# Altium schematic sheet PROC054D_AWR_2_AWR_3_LC_Filtering.SchDoc: AWR_2_AWR_3_LC_Filtering
size 558 x 431 mm; Date: Not shown in title block; ApprovedBy: Not shown in title block; CheckedBy: Not shown in title block; Author: Not shown in title block; CompanyName: Not shown in title block; DrawnBy: a0271760; Engineer: Not shown in title block; Organization: Not shown in title block; Address1: Not shown in title block; Address2: Not shown in title block; Address3: Not shown in title block; Address4: Not shown in title block; DocumentNumber: 7; Revision: Use project pAWRameter SCH_Rev; SheetNumber: 7; SheetTotal: 19; PageSetup: Record=PageOptions|CenterHorizontal=True|CenterVertical=True|PrintScale=1.00|XCorrection=1.00|YCorrection=1.00|PrintKind=0|BorderSize=5000000|LeftOffset=0|BottomOffset=0|Orientation=2|PaperLength=1000|PaperWidth=1000|Scale=100|PaperSource=15|PrintQuality=600|MediaType=1|DitherType=10|PaperKind=Letter|PrintScaleMode=1; CurrentTime: Not shown in title block; CurrentDate: Not shown in title block; Time: Not shown in title block; DocumentFullPathAndName: Not shown in title block; DocumentName: Not shown in title block; ModifiedDate: Not shown in title block; ImagePath: Not shown in title block
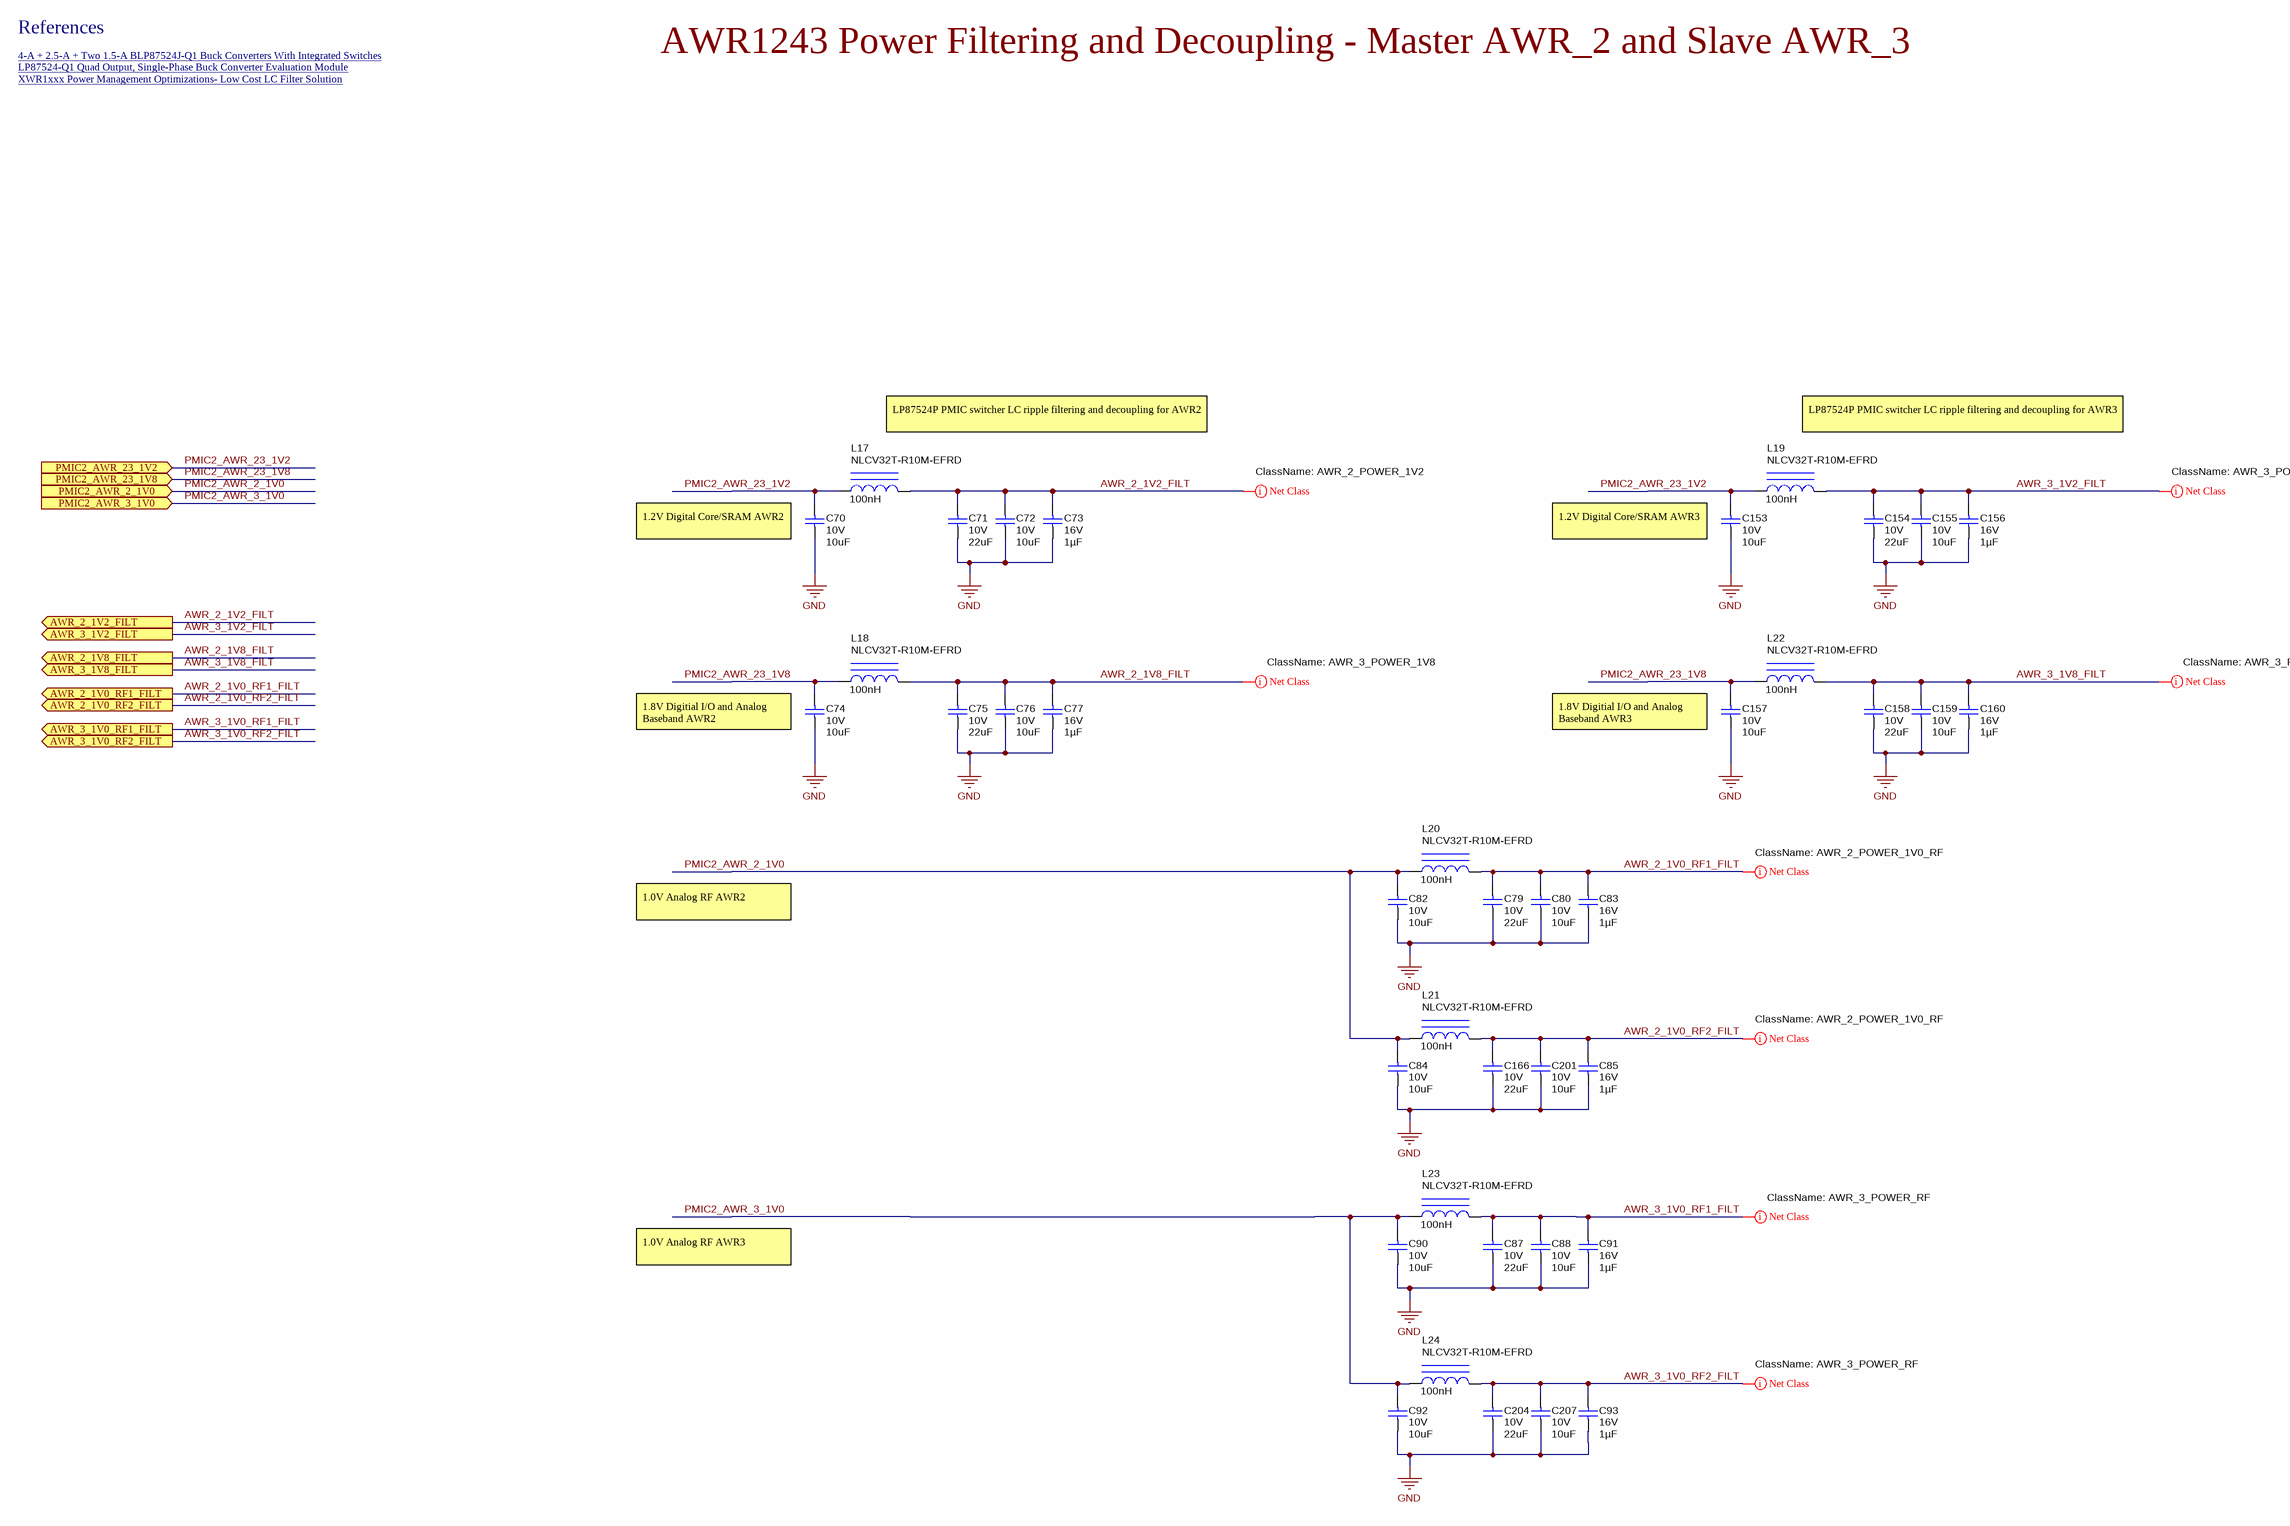
[diagram p0: PROC054D_AWR_2_AWR_3_LC_Filtering.SchDoc]

## Parts
C70  VDC_V: 10V  ValueDisplayed: 10uF  [0805L]  (hidden comment: GCM21BR71A106KE22L)
C71  VDC_V: 10V  ValueDisplayed: 22uF  [1206_180L]  (hidden comment: GCM31CR71A226KE02)
C72  VDC_V: 10V  ValueDisplayed: 10uF  [0805L]  (hidden comment: GCM21BR71A106KE22L)
C73  VDC_V: 16V  ValueDisplayed: 1µF  [0603S]  (hidden comment: GCM188R71C105KA64J)
C74  VDC_V: 10V  ValueDisplayed: 10uF  [0805L]  (hidden comment: GCM21BR71A106KE22L)
C75  VDC_V: 10V  ValueDisplayed: 22uF  [1206_180L]  (hidden comment: GCM31CR71A226KE02)
C76  VDC_V: 10V  ValueDisplayed: 10uF  [0805L]  (hidden comment: GCM21BR71A106KE22L)
C77  VDC_V: 16V  ValueDisplayed: 1µF  [0603S]  (hidden comment: GCM188R71C105KA64J)
C79  VDC_V: 10V  ValueDisplayed: 22uF  [1206_180L]  (hidden comment: GCM31CR71A226KE02)
C80  VDC_V: 10V  ValueDisplayed: 10uF  [0805L]  (hidden comment: GCM21BR71A106KE22L)
C82  VDC_V: 10V  ValueDisplayed: 10uF  [0805L]  (hidden comment: GCM21BR71A106KE22L)
C83  VDC_V: 16V  ValueDisplayed: 1µF  [0603S]  (hidden comment: GCM188R71C105KA64J)
C84  VDC_V: 10V  ValueDisplayed: 10uF  [0805L]  (hidden comment: GCM21BR71A106KE22L)
C85  VDC_V: 16V  ValueDisplayed: 1µF  [0603S]  (hidden comment: GCM188R71C105KA64J)
C87  VDC_V: 10V  ValueDisplayed: 22uF  [1206_180L]  (hidden comment: GCM31CR71A226KE02)
C88  VDC_V: 10V  ValueDisplayed: 10uF  [0805L]  (hidden comment: GCM21BR71A106KE22L)
C90  VDC_V: 10V  ValueDisplayed: 10uF  [0805L]  (hidden comment: GCM21BR71A106KE22L)
C91  VDC_V: 16V  ValueDisplayed: 1µF  [0603S]  (hidden comment: GCM188R71C105KA64J)
C92  VDC_V: 10V  ValueDisplayed: 10uF  [0805L]  (hidden comment: GCM21BR71A106KE22L)
C93  VDC_V: 16V  ValueDisplayed: 1µF  [0603S]  (hidden comment: GCM188R71C105KA64J)
C153  VDC_V: 10V  ValueDisplayed: 10uF  [0805L]  (hidden comment: GCM21BR71A106KE22L)
C154  VDC_V: 10V  ValueDisplayed: 22uF  [1206_180L]  (hidden comment: GCM31CR71A226KE02)
C155  VDC_V: 10V  ValueDisplayed: 10uF  [0805L]  (hidden comment: GCM21BR71A106KE22L)
C156  VDC_V: 16V  ValueDisplayed: 1µF  [0603S]  (hidden comment: GCM188R71C105KA64J)
C157  VDC_V: 10V  ValueDisplayed: 10uF  [0805L]  (hidden comment: GCM21BR71A106KE22L)
C158  VDC_V: 10V  ValueDisplayed: 22uF  [1206_180L]  (hidden comment: GCM31CR71A226KE02)
C159  VDC_V: 10V  ValueDisplayed: 10uF  [0805L]  (hidden comment: GCM21BR71A106KE22L)
C160  VDC_V: 16V  ValueDisplayed: 1µF  [0603S]  (hidden comment: GCM188R71C105KA64J)
C166  VDC_V: 10V  ValueDisplayed: 22uF  [1206_180L]  (hidden comment: GCM31CR71A226KE02)
C201  VDC_V: 10V  ValueDisplayed: 10uF  [0805L]  (hidden comment: GCM21BR71A106KE22L)
C204  VDC_V: 10V  ValueDisplayed: 22uF  [1206_180L]  (hidden comment: GCM31CR71A226KE02)
C207  VDC_V: 10V  ValueDisplayed: 10uF  [0805L]  (hidden comment: GCM21BR71A106KE22L)
L17  ValueDisplayed: 100nH  [NLCV32]  (hidden comment: NLCV32T-R10M-EFRD)
L18  ValueDisplayed: 100nH  [NLCV32]  (hidden comment: NLCV32T-R10M-EFRD)
L19  ValueDisplayed: 100nH  [NLCV32]  (hidden comment: NLCV32T-R10M-EFRD)
L20  ValueDisplayed: 100nH  [NLCV32]  (hidden comment: NLCV32T-R10M-EFRD)
L21  ValueDisplayed: 100nH  [NLCV32]  (hidden comment: NLCV32T-R10M-EFRD)
L22  ValueDisplayed: 100nH  [NLCV32]  (hidden comment: NLCV32T-R10M-EFRD)
L23  ValueDisplayed: 100nH  [NLCV32]  (hidden comment: NLCV32T-R10M-EFRD)
L24  ValueDisplayed: 100nH  [NLCV32]  (hidden comment: NLCV32T-R10M-EFRD)

## Ports
AWR_2_1V0_RF1_FILT (out), AWR_2_1V0_RF2_FILT (out), AWR_2_1V2_FILT (out), AWR_2_1V8_FILT (out), AWR_3_1V0_RF1_FILT (out), AWR_3_1V0_RF2_FILT (out), AWR_3_1V2_FILT (out), AWR_3_1V8_FILT (out), PMIC2_AWR_2_1V0 (in), PMIC2_AWR_3_1V0 (in), PMIC2_AWR_23_1V2 (in), PMIC2_AWR_23_1V8 (in)

## Nets
GND: C70.2 C71.2 C72.2 C73.2 C74.2 C75.2 C76.2 C77.2 C79.2 C80.2 C82.2 C83.2 C84.2 C85.2 C87.2 C88.2 C90.2 C91.2 C92.2 C93.2 C153.2 C154.2 C155.2 C156.2 C157.2 C158.2 C159.2 C160.2 C166.2 C201.2 C204.2 C207.2
AWR_2_1V0_RF1_FILT: C79.1 C80.1 C83.1 L20.2 ; port AWR_2_1V0_RF1_FILT
AWR_2_1V0_RF2_FILT: C85.1 C166.1 C201.1 L21.2 ; port AWR_2_1V0_RF2_FILT
AWR_2_1V2_FILT: C71.1 C72.1 C73.1 L17.2 ; port AWR_2_1V2_FILT
AWR_2_1V8_FILT: C75.1 C76.1 C77.1 L18.2 ; port AWR_2_1V8_FILT
AWR_3_1V0_RF1_FILT: C87.1 C88.1 C91.1 L23.2 ; port AWR_3_1V0_RF1_FILT
AWR_3_1V0_RF2_FILT: C93.1 C204.1 C207.1 L24.2 ; port AWR_3_1V0_RF2_FILT
AWR_3_1V2_FILT: C154.1 C155.1 C156.1 L19.2 ; port AWR_3_1V2_FILT
AWR_3_1V8_FILT: C158.1 C159.1 C160.1 L22.2 ; port AWR_3_1V8_FILT
PMIC2_AWR_2_1V0: C82.1 C84.1 L20.1 L21.1 ; port PMIC2_AWR_2_1V0
PMIC2_AWR_3_1V0: C90.1 C92.1 L23.1 L24.1 ; port PMIC2_AWR_3_1V0
PMIC2_AWR_23_1V2: C70.1 C153.1 L17.1 L19.1 ; port PMIC2_AWR_23_1V2
PMIC2_AWR_23_1V8: C74.1 C157.1 L18.1 L22.1 ; port PMIC2_AWR_23_1V8

## Layout directives
net class AWR_2_POWER_1V2: AWR_2_1V2_FILT
net class AWR_2_POWER_1V0_RF: AWR_2_1V0_RF1_FILT, AWR_2_1V0_RF2_FILT
net class AWR_3_POWER_RF: AWR_3_1V0_RF1_FILT, AWR_3_1V0_RF2_FILT
net class AWR_3_POWER_1V8: AWR_2_1V8_FILT, AWR_3_1V8_FILT
net class AWR_3_POWER_1V2: AWR_3_1V2_FILT

## Notes on the sheet
- References
- 4-A + 2.5-A + Two 1.5-A BLP87524J-Q1 Buck Converters With Integrated Switches <http://www.ti.com/product/lp87524j-q1>
- LP87524-Q1 Quad Output, Single-Phase Buck Converter Evaluation Module <http://www.ti.com/tool/lp87524q1evm>
- XWR1xxx Power Management Optimizations- Low Cost LC Filter Solution <http://www.ti.com/lit/pdf/swra577>
- AWR1243 Power Filtering and Decoupling - Master AWR_2 and Slave AWR_3
- LP87524P PMIC switcher LC ripple filtering and decoupling for AWR2
- LP87524P PMIC switcher LC ripple filtering and decoupling for AWR3
- (near C70) 1.2V Digital Core/SRAM AWR2
- (near C153) 1.2V Digital Core/SRAM AWR3
- (near C74) 1.8V Digitial I/O and Analog Baseband AWR2
- (near C157) 1.8V Digitial I/O and Analog Baseband AWR3
- 1.0V Analog RF AWR2
- 1.0V Analog RF AWR3
- Drawn By:
- SVN Rev:
- Number:
- TID #:
- Orderable:
- Rev:
- Sheet Title:
- File:
- Project Title:
- Designed for:
- Assembly VAWRiant:
- Mod. Date:
- Sheet:
- Size:
- of
- C
- http://www.ti.com
- Texas Instruments and/or its licensors do not wAWRrant the accuracy or completeness of this specification or any information contained therein. Texas Instruments and/or its licensors do not wAWRrant that this design will meet the specifications, will be suitable for your application or fit for any pAWRticulAWR purpose, or will operate in an implementation. Texas Instruments and/or its licensors do not wAWRrant that the design is production worthy. You should completely validate and test your design implementation to confirm the system functionality for your application.
- Engineer:
- Contact:
- © Texas Instruments

## Library data of the parts
C70 C72 C74 C76 C80 C82 C84 C88 C90 C92 C153 C155 C157 C159 C201 C207 = CMP-0008017-2: CAP, CERM, 10 uF, 10 V, +/- 10%, X7R, 0805; Manufacturer: MuRata; TaMin_C: -55°C; Polarized: N; SizeAreaWB_mm2: 6.75; Value1: Unknown; U/M: EA; Value: 10uF; TaMax_C: 125°C; SizeZ_mm: 1.45; SizeX_mm: 2; SizeY_mm: 1.25; Cap_Case: 0805; SizeArea_mm2: 2.5; Cap_F: 10µF; AEC Category: Q200; Supplier Part Number 2: 06AC6014; Publisher: Texas Instruments; Supplier 2: Newark; Supplier Part Number 3: 81-GCM21BR71A106KE2L; TempCo: X7R; Supplier 3: Mouser; Published: 2008-06-19; RoHS: Y; MountType: SMT; Supplier 1: Digi-Key; PackageReference: 0805; Tolerance_%: 10%; Value2: 10V; CompType: Capacitor; LatestRevisionDate: 2017-03-09; PartNumber: GCM21BR71A106KE22L; AEC Qualified: ?; ComponentLink1Description: Datasheet link; Supplier Part Number 1: 490-10674-1-ND; Technology: Ceramic; ComponentLink1URL: http://www.murata.com/products/catalog/pdf/c03e.pdf
C71 C75 C79 C87 C154 C158 C166 C204 = CMP-0008811-2: CAP, CERM, 22 uF, 10 V, +/- 10%, X7R, AEC-Q200 Grade 1, 1206; Manufacturer: MuRata; TaMin_C: -55°C; Polarized: N; SizeAreaWB_mm2: 10.92; Value1: Unknown; U/M: EA; Value: 22uF; TaMax_C: 125°C; SizeZ_mm: 1.8; SizeX_mm: 3.2; SizeY_mm: 1.6; Cap_Case: 1206; SizeArea_mm2: 5.12; AEC Qualified: Y; Cap_F: 22µF; AEC Grade: 1; AEC Category: Q200; Publisher: Texas Instruments; TempCo: X7R; Published: 2008-06-19; RoHS: Y; MountType: SMT; PackageReference: 1206; Tolerance_%: 10%; Value2: 10V; CompType: Capacitor; LatestRevisionDate: 2017-03-09; PartNumber: GCM31CR71A226KE02; ComponentLink1Description: Datasheet link; Technology: Ceramic; ComponentLink1URL: http://psearch.en.murata.com/capacitor/product/GCM31CR71A226KE02%23.pdf
C73 C77 C83 C85 C91 C93 C156 C160 = CMP-0079154-1: CAP, CERM, 1 µF, 16 V,+/- 10%, X7R, AEC-Q200 Grade 1, 0603; Manufacturer: MuRata; SizeAreaWB_mm2: 4.68; SizeArea_mm2: 1.28; AEC Qualified: Y; AEC Category: Q200; Value: 1uF; TaMax_C: 125°C; SizeZ_mm: 1; Polarized: N; TaMin_C: -55°C; SizeY_mm: 0.8; U/M: EA; SizeX_mm: 1.6; Cap_Case: 0603; ComponentLink1Description: Datasheet link; Cap_F: 1µF; RoHS: Y; Tolerance_%: 10%; Supplier 1: Digi-Key; PackageReference: 0603; Technology: Ceramic; PartNumber: GCM188R71C105KA64J; TempCo: X7R; Supplier Part Number 2: 81-GCM188R71C105KA4J; Supplier 2: Mouser; AEC Grade: 1; Value2: 16V; ComponentLink1URL: https://www.murata.com/~/media/webrenewal/support/library/catalog/products/capacitor/mlcc/c03e.ashx; CompType: Capacitor; MountType: SMT; Supplier Part Number 1: 490-12657-1-ND
L17-L24 = CMP-0083745-1: Inductor, Wirewound, Ferrite, 100 nH, 2.85 A, 0.024 ohm, AEC-Q200 Grade 1, SMD; Manufacturer: TDK; Isat: 2.85A @ 10% inductance drop; Irms: 2.85A @ 40C rise; SizeAreaWB_mm2: 13.44; DCR_ohm: 0.024; Value: 100nH; Imax_A: 2.85A; SizeZ_mm: 2.5; SizeX_mm: 3.2; SizeY_mm: 2.2; SizeArea_mm2: 7.04; AEC Qualified: Y; AEC Grade: 1; AEC Category: Q200; ComponentLink1URL: https://product.tdk.com/info/en/catalog/datasheets/inductor_automotive_decoupling_nlcv32-efrd_en.pdf; RoHS: Y; Value1: 0.024 ohm; Material: Ferrite; MountType: SMT; PackageReference: 3.2x2.2x2.5mm; Value2: 2.85A; CompType: Inductor; Ind_H: 100nH; PartNumber: NLCV32T-R10M-EFRD; ComponentLink1Description: Datasheet link; Technology: Wirewound